# Altium project Adafruit BNO055.PrjPcb
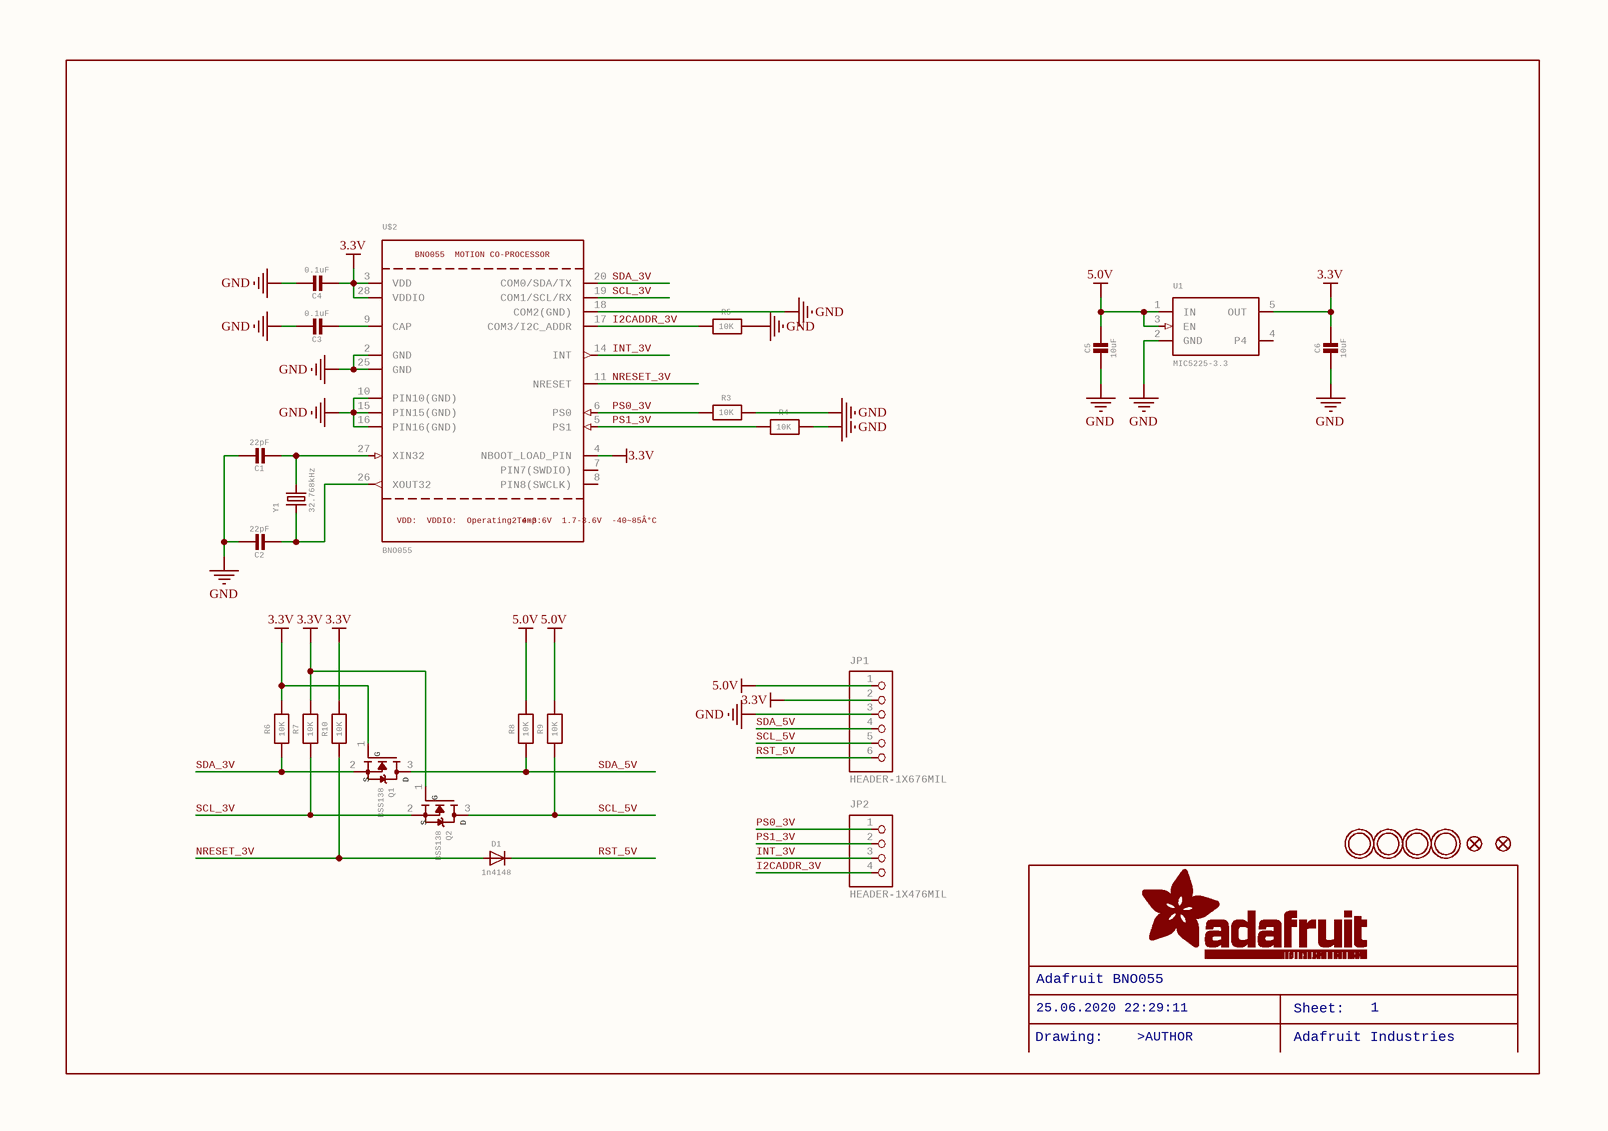
[diagram p0: Adafruit BNO055.SchDoc]
1 sheet, 28 parts. Net scope: global (net labels, ports and power ports of the same name join across sheets).
Board file: Adafruit BNO055.PcbDoc

## Sheet Adafruit BNO055.SchDoc: Adafruit BNO055
size 282 x 197 mm; Origin: Eagle; Date: 25.06.2020 22:29:11; SheetNumber: 1; Author: >AUTHOR; GateName_1: G$1; SymbolName_1: FRAME_A4_ADAFRUIT; LibraryName: microbuilder; DeviceSetName: FRAME_A4_ADAFRUIT; Sheet: Sheet:; AdafruitIndustries: Adafruit Industries; Drawing: Drawing:

### Parts
C1  22pF  [0805-NO]
C2  22pF  [0805-NO]
C3  0.1uF  [0805-NO]
C4  0.1uF  [0805_10MGAP]
C5  10uF  [0805-NO]
C6  10uF  [0805_10MGAP]
D1  1n4148  [SOD-323]
FID1  FIDUCIAL""  [FIDUCIAL_1MM]  (value not drawn)
FID2  FIDUCIAL""  [FIDUCIAL_1MM]  (value not drawn)
JP1  HEADER-1X676MIL  [1X06_ROUND_76]
JP2  HEADER-1X476MIL  [1X04_ROUND_76]
Q1  BSS138  [SOT23-WIDE]
Q2  BSS138  [SOT23-WIDE]
R3  10K  [0805-NO]
R4  10K  [0805-NO]
R5  10K  [0805-NO]
R6  10K  [0805-NO]
R7  10K  [0805-NO]
R8  10K  [_0805MP]
R9  10K  [_0805MP]
R10  10K  [0805-NO]
U1  MIC5225-3.3  [SOT23-5]
U$2  BNO055  BNO055
MOTIONCO-PROCESSOR: BNO055 / MOTION CO-PROCESSOR  VDD:
VDDIO:
OperatingTemp: VDD: / VDDIO: / Operating Temp:  2.4-3.6V
1.7-3.6V
-40~85Â°C: 2.4-3.6V / 1.7-3.6V / -40~85Â°C  [BNO055]
U$29  MOUNTINGHOLE2.5_THICK  [MOUNTINGHOLE_2.5_PLATED_THICK]  (value not drawn)
U$30  MOUNTINGHOLE2.5_THICK  [MOUNTINGHOLE_2.5_PLATED_THICK]  (value not drawn)
U$31  MOUNTINGHOLE2.5_THICK  [MOUNTINGHOLE_2.5_PLATED_THICK]  (value not drawn)
U$32  MOUNTINGHOLE2.5_THICK  [MOUNTINGHOLE_2.5_PLATED_THICK]  (value not drawn)
Y1  32.768kHz  [CRYSTAL_8X3.8]

### Nets
3.3V: C4.2 C6.1 JP1.2 Q1.1(G) Q2.1(G) R6.2 R7.2 R10.2 U1.5(OUT) U$2.3(VDD) U$2.4(NBOOT_LOAD_PIN) U$2.28(VDDIO)
5.0V: C5.1 JP1.1 R8.2 R9.2 U1.1(IN) U1.3(EN)
GND: C1.1 C2.1 C3.1 C4.1 C5.2 C6.2 JP1.3 R3.2 R4.2 R5.2 U1.2(GND) U$2.2(GND) U$2.10(PIN10(GND)) U$2.15(PIN15(GND)) U$2.16(PIN16(GND)) U$2.18(COM2(GND)) U$2.25(GND)
I2CADDR_3V: JP2.4 R5.1 U$2.17(COM3/I2C_ADDR)
INT_3V: JP2.3 U$2.14(INT)
NRESET_3V: D1.A R10.1 U$2.11(NRESET)
PS0_3V: JP2.1 R3.1 U$2.6(PS0)
PS1_3V: JP2.2 R4.1 U$2.5(PS1)
RST_5V: D1.C JP1.6
SCL_3V: Q2.2(S) R7.1 U$2.19(COM1/SCL/RX)
SCL_5V: JP1.5 Q2.3(D) R9.1
SDA_3V: Q1.2(S) R6.1 U$2.20(COM0/SDA/TX)
SDA_5V: JP1.4 Q1.3(D) R8.1
NetC1_2: C1.2 U$2.27(XIN32) Y1.P$4
NetC2_2: C2.2 U$2.26(XOUT32) Y1.P$1
NetC3_2: C3.2 U$2.9(CAP)

Not connected (* = marked no-connect by the designer): U1 4(P4); U$2 7(PIN7(SWDIO)) 8(PIN8(SWCLK))

### Notes on the sheet
- Adafruit BNO055
- 25.06.2020 22:29:11
- Sheet:
- 1
- Drawing:
- >AUTHOR
- Adafruit Industries

### Library data of the parts
C1-C3 C5 = CAP_CERAMIC0805-NOOUTLINE: Ceramic Capacitors   For new designs, use the packages preceded by an '_' character since they are more reliable:   The following footprints should be used on most boards: _0402 - Standard footprint for regular board layouts  _0603 - Standard footprint for regular board layouts  _0805 - Standard footprint for regular board layouts  _1206 - Standard footprint for regular board layouts       For extremely tight-pitch boards where space is at a premium, the following 'micro-pitch' footprints can be used (smaller pads, no silkscreen outline, etc.): _0402MP - Micro-pitch footprint for very dense/compact boards  _0603MP - Micro-pitch footprint for very dense/compact boards  _0805MP - Micro-pitch footprint for very dense/compact boards  _1206MP - Micro-pitch footprint for very dense/compact boards; GateName_1: G$1; SymbolName_1: CAPACITOR; DeviceName: 0805-NOOUTLINE; LibraryName: microbuilder; DeviceSetName: CAP_CERAMIC
C4 C6 = CAP_CERAMIC0805_10MGAP: Ceramic Capacitors   For new designs, use the packages preceded by an '_' character since they are more reliable:   The following footprints should be used on most boards: _0402 - Standard footprint for regular board layouts  _0603 - Standard footprint for regular board layouts  _0805 - Standard footprint for regular board layouts  _1206 - Standard footprint for regular board layouts       For extremely tight-pitch boards where space is at a premium, the following 'micro-pitch' footprints can be used (smaller pads, no silkscreen outline, etc.): _0402MP - Micro-pitch footprint for very dense/compact boards  _0603MP - Micro-pitch footprint for very dense/compact boards  _0805MP - Micro-pitch footprint for very dense/compact boards  _1206MP - Micro-pitch footprint for very dense/compact boards; GateName_1: G$1; SymbolName_1: CAPACITOR; DeviceName: 0805_10MGAP; LibraryName: microbuilder; DeviceSetName: CAP_CERAMIC
D1 = DIODESOD-323: Diode    SMA      Model	  Volts	  Amps	  Type	  Vf	  Ir	  Digikey #	  Notes	     SSA34-E3	  40V	  3A	  Schottky	  480mV @ 3A	  200uA @ 40V	  SSA34-E3/61TGITR-ND	  	     CDBA120-G	  20V	  1A	  Schottky	  500mV @ 1A	  500uA @ 20V	  641-1014-6-ND	  REEL	     MBRA210	  10V	  2A	  Schottky	  350mV @ 2A	  700uA @ 10V	  MBRA210LT3	  	 SOD-123      Model	  Volts	  Amps	  Type	  Vf	  Ir	  Order #	  Notes	     BAT54T1G	  30V	  200mA	  Schottky	  800mV @ 200mA	  2uA @ 25V	  BAT54T1GOSTR-ND	  	     B0530W	  30V	  500mA	  Schottky	  430mV @ 500mA	  130uA @ 30V	  B0530W-FDICT-ND	  REEL	     MBR120	  20V	  1A	  Schottky	  340mV @ 1A	  	  MBR120VLSFT1GOSCT-ND	  	 SOD-323      Model	  Volts	  Amps	  Type	  Vf	  Ir	  Order #	  Notes	     PMEG2005EJ	  20V	  500mA	  Schottky	  355mV @ 500mA	  	  568-4110-1-ND	  	     ZLLS410	  10V	  570mA	  Schottky	  380mV @ 570mA	  	  ZLLS410CT-ND	  	     1N4148WS	  75V	  150mA	  Silicon/Simple	  1V	  	  1N4148WSFSCT-ND	  REEL	 SOD-523      Model	  Volts	  Amps	  Type	  Vf	  Ir	  Order #	  Notes	     BAT54XV2	  30V	  200mA	  Schottky	  0.8V @ 100mA	  	  BAT54XV2CT-ND	  	     TB751S	  30V	  30mA	  Schottky	  	  	  RB751S-40TE61CT-ND	  	 SOT23-R/W (R = Solder Paste/Reflow Ovens, W = Hand-Soldering)       Model	  Volts	  Amps	  Type	  Vf	  Ir	  Order #	  Notes	     BAT54FILM	  40V	  300mA	  Schottky	  	  	  497-7162-1-ND	  	 POWERDI-5       Model	  Volts	  Amps	  Type	  Vf	  Ir	  Order #	  Notes	     PDS560	  60V	  5A	  Schottky	  670mV @ 5A	  150uA @ 60V	  PDS560DICT-ND; GateName_1: G$1; SymbolName_1: DIODE; DeviceName: SOD-323; LibraryName: microbuilder; DeviceSetName: DIODE
FID1 FID2 = FIDUCIAL"": Fiducial Alignment Points   Various fiducial points for machine vision alignment.; GateName_1: G$1; DeviceName: ""; BOM: EXCLUDE; SymbolName_1: FIDUCIAL; LibraryName: microbuilder; DeviceSetName: FIDUCIAL
JP1 = HEADER-1X676MIL: PIN HEADER; GateName_1: A; SymbolName_1: PINHD6; DeviceName: 76MIL; LibraryName: microbuilder; DeviceSetName: HEADER-1X6
JP2 = HEADER-1X476MIL: PIN HEADER; GateName_1: A; SymbolName_1: PINHD4; DeviceName: 76MIL; LibraryName: microbuilder; DeviceSetName: HEADER-1X4
Q1 Q2 = MOSFET-NWIDE: N-Channel Mosfet   LEGEND   VDS: Voltage Drain-Source ID: Drain Current RDS(ON): Drain-Source On-State Resistance VGS(TH): Gate-Source Threshold Voltage CISS: Drain-Source Input Capacitance    SOT-23   Name	VDS	ID	RDS(ON)	VGS(TH)	CISS	Order Number	   2N7002E	60V	260mA	2.5 Ohm	2.5V @ 250uA	26.7pF @ 25V	2N7002ET1GOSTR-ND	   BSH103	30V	850mA	400 mOhm	400mV @ 1mA	83pF @ 24V	BSH103,235-ND	   BSS138	60V	320mA	1.6 Ohm	1.5V @ 250uA	50pF @ 10V	Mouser: 771-BSS138PW115	   DMN2075U-7	20V	4.2A	38 mOhm	1V @ 250 uA	594.3pF @ 10V	DMN2075U-7DICT-ND	   							   * BSS138 good choice for I2C level-shifting   POWERPAK 1212-8   Name	VDS	ID	RDS(ON)	VGS(TH)	CISS	Order Number	   Si7308DN	60V	6A	58 mOhm	3V @ 250uA	665pF @ 15V	SI7308DN-T1-E3CT-ND; GateName_1: G$1; DeviceName: WIDE; SymbolName_1: MOSFET-N; LibraryName: microbuilder; DeviceSetName: MOSFET-N; D: D; S: S; G: G
R3-R7 R10 = RESISTOR0805_NOOUTLINE: Resistors   For new designs, use the packages preceded by an '_' character since they are more reliable:   The following footprints should be used on most boards: _0402 - Standard footprint for regular board layouts  _0603 - Standard footprint for regular board layouts  _0805 - Standard footprint for regular board layouts  _1206 - Standard footprint for regular board layouts       For extremely tight-pitch boards where space is at a premium, the following 'micro-pitch' footprints can be used (smaller pads, no silkscreen outline, etc.): _0402MP - Micro-pitch footprint for very dense/compact boards  _0603MP - Micro-pitch footprint for very dense/compact boards  _0805MP - Micro-pitch footprint for very dense/compact boards  _1206MP - Micro-pitch footprint for very dense/compact boards; GateName_1: G$1; SymbolName_1: RESISTOR; DeviceName: 0805_NOOUTLINE; LibraryName: microbuilder; DeviceSetName: RESISTOR
R8 R9 = RESISTOR_0805MP: Resistors   For new designs, use the packages preceded by an '_' character since they are more reliable:   The following footprints should be used on most boards: _0402 - Standard footprint for regular board layouts  _0603 - Standard footprint for regular board layouts  _0805 - Standard footprint for regular board layouts  _1206 - Standard footprint for regular board layouts       For extremely tight-pitch boards where space is at a premium, the following 'micro-pitch' footprints can be used (smaller pads, no silkscreen outline, etc.): _0402MP - Micro-pitch footprint for very dense/compact boards  _0603MP - Micro-pitch footprint for very dense/compact boards  _0805MP - Micro-pitch footprint for very dense/compact boards  _1206MP - Micro-pitch footprint for very dense/compact boards; GateName_1: G$1; SymbolName_1: RESISTOR; DeviceName: _0805MP; LibraryName: microbuilder; DeviceSetName: RESISTOR
U1 = VREG_SOT23-5: SOT23-5 Fixed Voltage Regulators      Part	Current Out	V Out	V In	V Dropout	Î¸JA (Â°C/W)	TJ (Â°C)	Digikey Part No.	     ADP121	  150mA	  3.3V	  3.4-5.5V	  0.09V @ 150mA	  --	  --	  ADP121-AUJZ33R7CT-ND	     ADP121	  150mA	  3.0V	  3.1-5.5V	  0.09V @ 150mA	  --	  --	  ADP121-AUJZ30R7CT-ND	     ADP122	  300mA	  3.3V	  3.4-5.5V	  0.085V @ 300mA	  --	  --	  ADP122AUJZ-3.3-R7CT-ND	     ADP1712	  300mA	  3.3V	  3.5-5.5V	  0.17V @ 300mA	  --	  --	  ADP1712AUJZ-3.3-R7TR-ND	     AP7311 (Low Cost)	  150mA	  3.3V	  3.5-6V	  0.15V @ 150mA	  --	  --	  AP7311-33WG-7DICT-ND	     LD39015M18R	  150mA	  1.8V	  1.9V-5.5V	  0.08V @ 100mA	  --	  --	  497-6977-1-ND	     LP2985A-33DBVR	  150mA	  3.3V	  3.3-16V	  0.28V @ 150mA	  206	  150	  296-18479-1-ND	     MCP1824T-3302E/OT	  300mA	  3.3V	  3.5V-6V	  0.2V @ 300mA	  --	  --	  MCP1824T-3302E/OTCT-ND	     MIC5205-2.5YM5 TR	  150mA	  2.5V	  2.7-16V	  0.165V @ 150mA	  --	  --	  576-1257-2-ND	     MIC5205-3.0YM5 TR	  150mA	  3.0V	  3.2V-16V	  0.165V @ 150mA	  --	  --	  576-1258-2-ND	     MIC5205-3.3YM5 TR	  150mA	  3.3V	  3.5V-16V	  0.165V @ 150mA	  --	  --	  576-1259-2-ND	     TPS780330220	  150mA	  3.3V+2.2V	  3.6-5.5V	  250mV Max	  --	  --	  296-23332-1-ND	     TDA3663/N1,135	  100mA	  3.3V	  3.5-45V	  0.18V @ 50mA	  --	  --	  568-5343-1-ND	     	  	  	  	  	  	  	  	     	  	  	  	  	  	  	  	   Max operating temp can be calculated using Î¸JA, TJ (max junction temperature), and power in watts.  Set the "Maximum Ambient Temperature" until it reaches TJ ("Max Junction Temperature"), which is the absolute limit for safe use of the regulator: Heat Sink Temperature Calculator   For example, With 12V source into a 3.3V LP2985 and a 30mA load, we are dissipating (12V-3.3V) * 0.03A = 0.261W.  With a Î¸JA of 206 Â°C/W, a TJ of 150Â°C, and 261mW we can safely use the chip without a heat sink up to 75Â°C (=147.1Â°C Junction Temperature).; GateName_1: G$1; SymbolName_1: VREG_SOT23-5; LibraryName: microbuilder; DeviceSetName: VREG_SOT23-5
U$2 = BNO055: BNO055 - Motion Co-Processor; GateName_1: G$1; SymbolName_1: BNO055; LibraryName: microbuilder; DeviceSetName: BNO055
U$29-U$32 = MOUNTINGHOLE2.5_THICK: Mounting Hole   For #2 screws (0.086"/2.18mm width, 0.094"/2.4mm hole) use 2.5mm; GateName_1: G$1; BOM: EXCLUDE; SymbolName_1: MOUNTINGHOLE; DeviceName: 2.5_THICK; LibraryName: microbuilder; DeviceSetName: MOUNTINGHOLE
Y1 = CRYSTAL8.0X3.8: Crystals   HC49UP - Surface Mount Crystal  4.0MHz 18pF +/-30ppm Surface Mount Crystal [Digikey: 535-9857-1-ND]  12.0 MHz Surface Mount Crystal [Digikey: 535-9869-6-ND]  25.0 MHz Surface Mount Crystal [Digikey: 535-9078-1-ND]       2.5 x 2.0mm - MEMs SMT Crystal  16.0 MHz 10pF 20ppm 2.5 x 2.0mm Crystal [Digikey -40-85Â°C: 535-10923-1-ND]       3.2 x 2.5mm - MEMs SMT Crystal  12.0 MHz 8pF 15ppm 3.2 x 2.5mm Crystal [Digikey: -10-70Â°C: 644-1047-1-ND -40-125Â°C: 644-1128-1-ND] 40~85Â°C cheaper: 644-1173-6-ND  16.0 MHz 8pF 15ppm 3.2 x 2.5mm Crystal [Digikey: -10-70Â°C: 644-1049-1-ND -40-125Â°C: 644-1129-2-ND]-40~85Â°C cheaper: 644-1175-6-ND  16.0 MHz 10pF 10ppm 3.2 x 2.5mm Crystal [Digikey: 644-1100-1-ND]  27.12 MHz 18pF 30ppm 3.2 x 2.5mm Crystal [Digikey: 887-1424-1-ND]  27.12MHz 10pF 10ppm 3.2 x 2.5mm Crystal [Digikey: 887-1329-1-ND]       4.9 x 1.8mm - MEMs SMT Crystal  32.768 KHz 12.5pF 20ppm 4.9 x 1.8mm Crystal [Digikey: SE2415CT-ND]       8.0 x 3.8mm - Surface Mount Crystal  32.768kHz 12.5pF 20ppm -40Â°C-85Â°C [Digikey: 535-9166-2-ND]       Cylinder 32.768KHz Cylinder Crystal (2x6mm body) [Ex. Digikey: 300-8341-2-ND]; GateName_1: G$1; SymbolName_1: CRYSTAL; DeviceName: 8.0X3.8; LibraryName: microbuilder; DeviceSetName: CRYSTAL